# EAGLE design Lighttile (EAGLE 5.11)
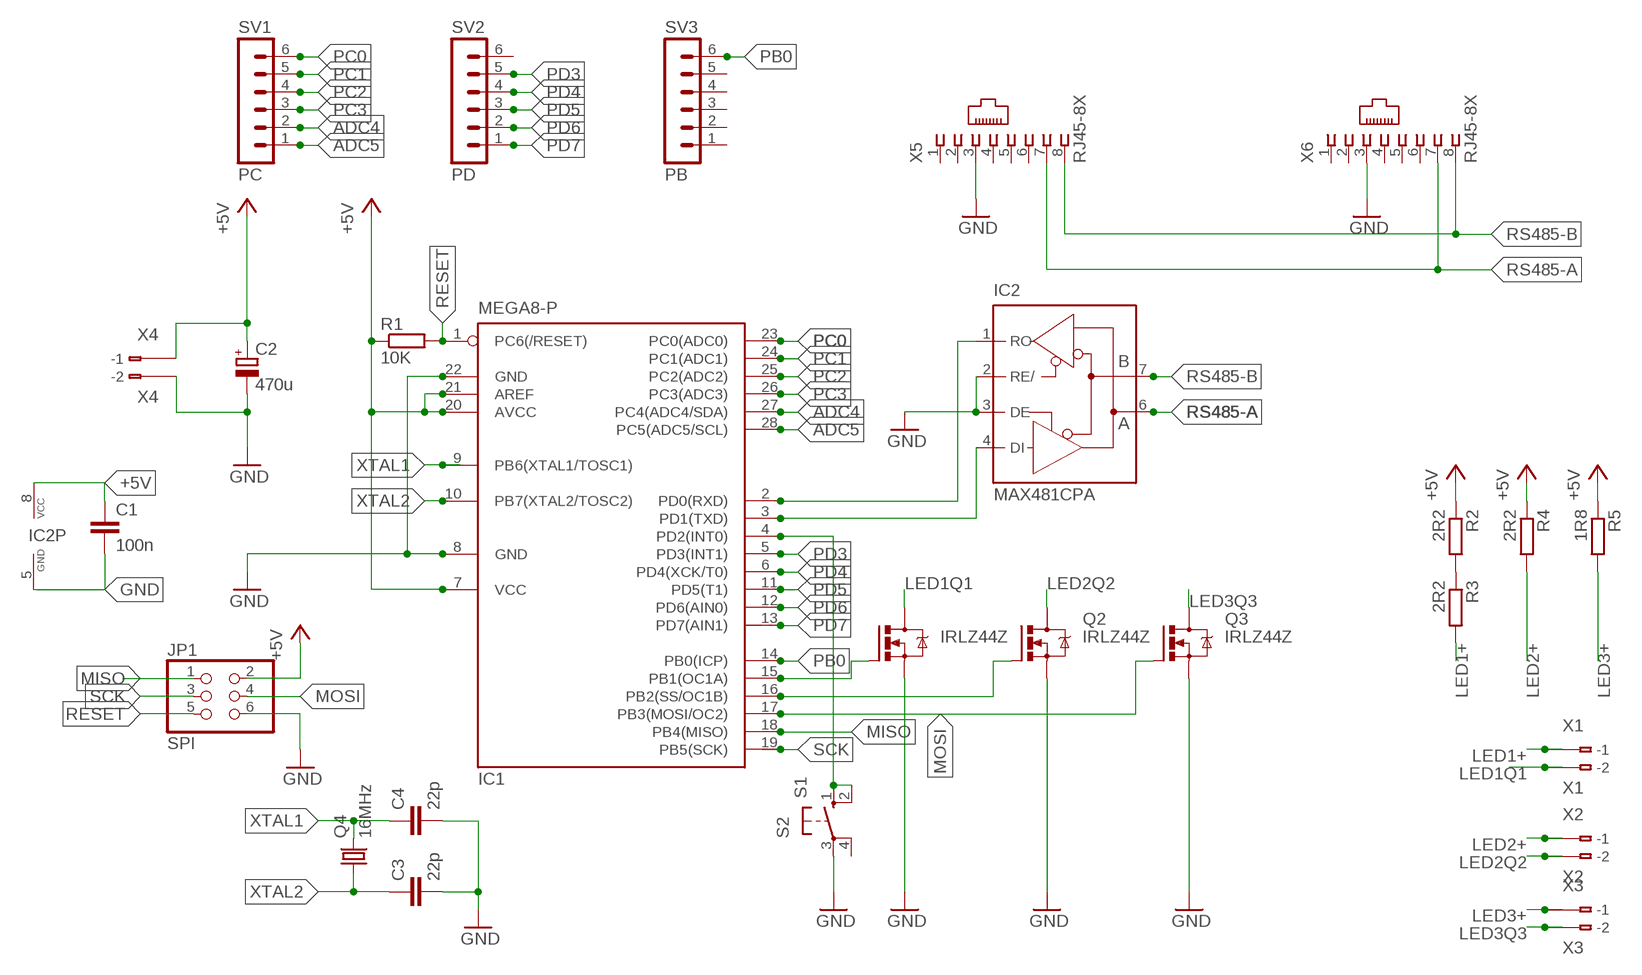
[diagram p0: schematic, sheet 1]

## Parts
C1  100n  C-EU025-024X044  [C025-024X044]
C2  470u  CPOL-EUE2.5-6  [E2,5-6]
C3  22p  C-EU025-024X044  [C025-024X044]
C4  22p  C-EU025-024X044  [C025-024X044]
IC1  MEGA8-P  [DIL28-3]
IC2  MAX481CPA  [DIL08]
JP1  SPI  PINHD-2X3  [2X03]
Q1  IRLZ44Z  [TO220BH]
Q2  IRLZ44Z  [TO220BH]
Q3  IRLZ44Z  [TO220BH]
Q4  16MHz  CRYSTALHC49S  [HC49/S]
R1  10K  R-EU_0207/15  [0207/15]
R2  2R2  R-EU_0414/15  [0414/15]
R3  2R2  R-EU_0414/15  [0414/15]
R4  2R2  R-EU_0414/15  [0414/15]
R5  1R8  R-EU_0414/15  [0414/15]
S2  S1  10-XX  [B3F-10XX]
SV1  PC  MA06-1  [MA06-1]
SV2  PD  MA06-1  [MA06-1]
SV3  PB  MA06-1  [MA06-1]
X1  X1  233-202  [233-202]
X2  X2  233-202  [233-202]
X3  X3  233-202  [233-202]
X4  X4  233-202  [233-202]
X5  RJ45-8X  [RJ45-NO-SHIELD]
X6  RJ45-8X  [RJ45-NO-SHIELD]

## Nets
+5V: C1.1 C2.+ IC1.7(VCC) IC1.20(AVCC) IC1.21(AREF) IC2.8(VCC) JP1.2 R1.1 R2.1 R4.1 R5.1 X4.B1(B-1)
ADC4: IC1.27(PC4(ADC4/SDA)) SV1.2
ADC5: IC1.28(PC5(ADC5/SCL)) SV1.1
GND: C1.2 C2.- C3.2 C4.2 IC1.8(GND) IC1.22(GND) IC2.2(RE/) IC2.3(DE) IC2.5(GND) JP1.6 Q1.S Q2.S Q3.S S2.3(P) X4.B2(B-2) X5.3 X6.3
LED1+: R3.2 X1.A1(-1) X1.B1(B-1)
LED1Q1: Q1.D X1.A2(-2) X1.B2(B-2)
LED2+: R4.2 X2.A1(-1) X2.B1(B-1)
LED2Q2: Q2.D X2.A2(-2) X2.B2(B-2)
LED3+: R5.2 X3.A1(-1) X3.B1(B-1)
LED3Q3: Q3.D X3.A2(-2) X3.B2(B-2)
MISO: IC1.18(PB4(MISO)) JP1.1
MOSI: IC1.17(PB3(MOSI/OC2)) JP1.4 Q3.G
N$1: IC1.4(PD2(INT0)) S2.1(S) S2.2(S1)
N$2: R2.2 R3.1
N$5: IC1.15(PB1(OC1A)) Q1.G
N$6: IC1.16(PB2(SS/OC1B)) Q2.G
N$18: IC1.2(PD0(RXD)) IC2.1(RO)
N$19: IC1.3(PD1(TXD)) IC2.4(DI)
PB0: IC1.14(PB0(ICP)) SV3.6
PC0: IC1.23(PC0(ADC0)) SV1.6
PC1: IC1.24(PC1(ADC1)) SV1.5
PC2: IC1.25(PC2(ADC2)) SV1.4
PC3: IC1.26(PC3(ADC3)) SV1.3
PD3: IC1.5(PD3(INT1)) SV2.5
PD4: IC1.6(PD4(XCK/T0)) SV2.4
PD5: IC1.11(PD5(T1)) SV2.3
PD6: IC1.12(PD6(AIN0)) SV2.2
PD7: IC1.13(PD7(AIN1)) SV2.1
RESET: IC1.1(PC6(/RESET)) JP1.5 R1.2
RS485-A: IC2.6(A) X5.7 X6.7
RS485-B: IC2.7(B) X5.8 X6.8
SCK: IC1.19(PB5(SCK)) JP1.3
XTAL1: C4.1 IC1.9(PB6(XTAL1/TOSC1)) Q4.2
XTAL2: C3.1 IC1.10(PB7(XTAL2/TOSC2)) Q4.1
Unconnected: S2.4(P1) SV2.6 SV3.1 SV3.2 SV3.3 SV3.4 SV3.5 X4.A1(-1) X4.A2(-2) X5.1 X5.2 X5.4 X5.5 X5.6 X6.1 X6.2 X6.4 X6.5 X6.6

## Library data of the parts
C1 C3 C4 = resistor:C-EU: CAPACITOR, European symbol
C2 = resistor:CPOL-EU: POLARIZED CAPACITOR, European symbol
IC1 = atmel:MEGA8-P: MICROCONTROLLER 8 Kbytes FLASH, 1 kbytes SRAM, 512 bytes EEPROM, USART, 4-channel 10 bit ADC, 2-channel 8 bit ADC Pin compatible with Atmega48, ATMega88, ATMega168 Source: avr.lbr; OC_FARNELL: unknown; OC_NEWARK: unknown
IC2 = maxim:MAX481CPA: RS485 TRANSEIVER; MPN: MAX481CPA+; OC_FARNELL: unknown; OC_NEWARK: 99K3445
JP1 = pinhead:PINHD-2X3: PIN HEADER
Q1-Q3 = transistor-power:IRLZ44Z: N-Channel HEXFET® Power MOSFET Logic Level AUTOMOTIVE MOSFET Source: http://www.irf.com/product-info/datasheets/data/irlz44zpbf.pdf
Q4 = crystal:CRYSTAL: CRYSTAL; OC_FARNELL: 1667008; OC_NEWARK: unknown
R1 = resistor:R-EU_: RESISTOR, European symbol
R2-R5 = rcl:R-EU_: RESISTOR, European symbol
S2 = switch-omron:10-XX: OMRON SWITCH; MPN: B3F-1000; OC_FARNELL: 176432; OC_NEWARK: 36M3542
SV1-SV3 = con-lstb:MA06-1: PIN HEADER; OC_FARNELL: unknown; OC_NEWARK: unknown
X1-X4 = con-wago:233-202: WAGO Cage Clamp; MPN: 233-202; OC_FARNELL: 1283532; OC_NEWARK: 28K9059
X5 X6 = con-tycoelectronics:RJ45: CORCOM Modular RJ Jacks No Shield Source: www.tycoelectronics.com .. ENG_DS_1654001_1099_RJ_L_0507.pdf; MPN: RJ45-8X; OC_FARNELL: unknown; OC_NEWARK: 16R6101

## Board
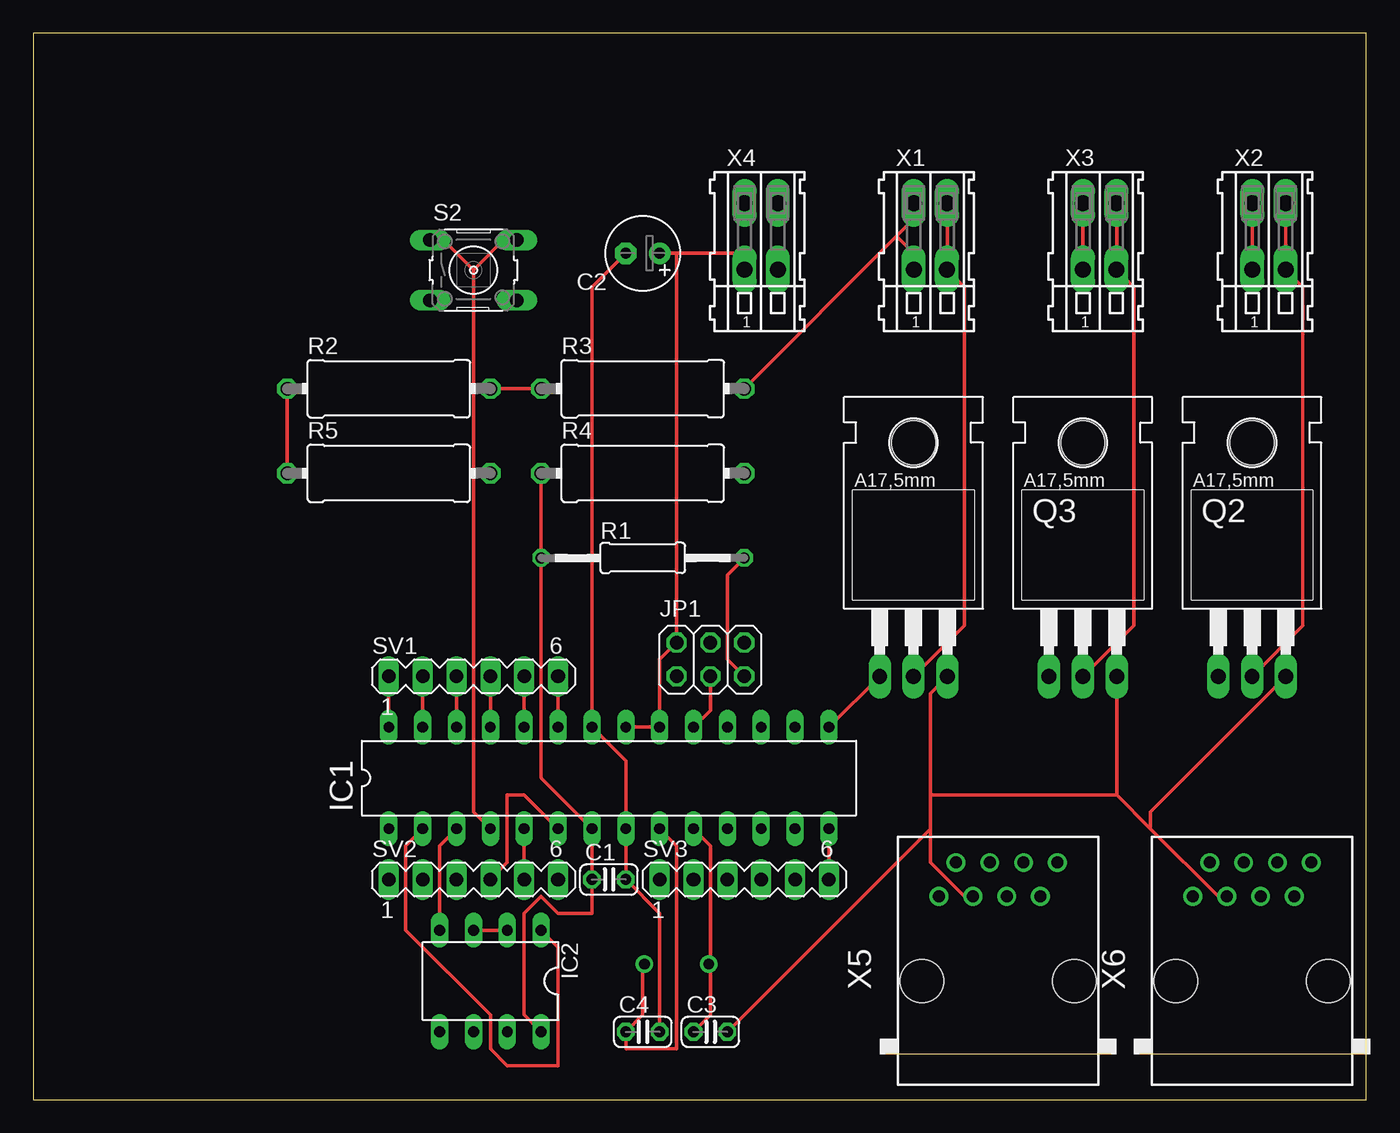
[diagram p1: board, top side]
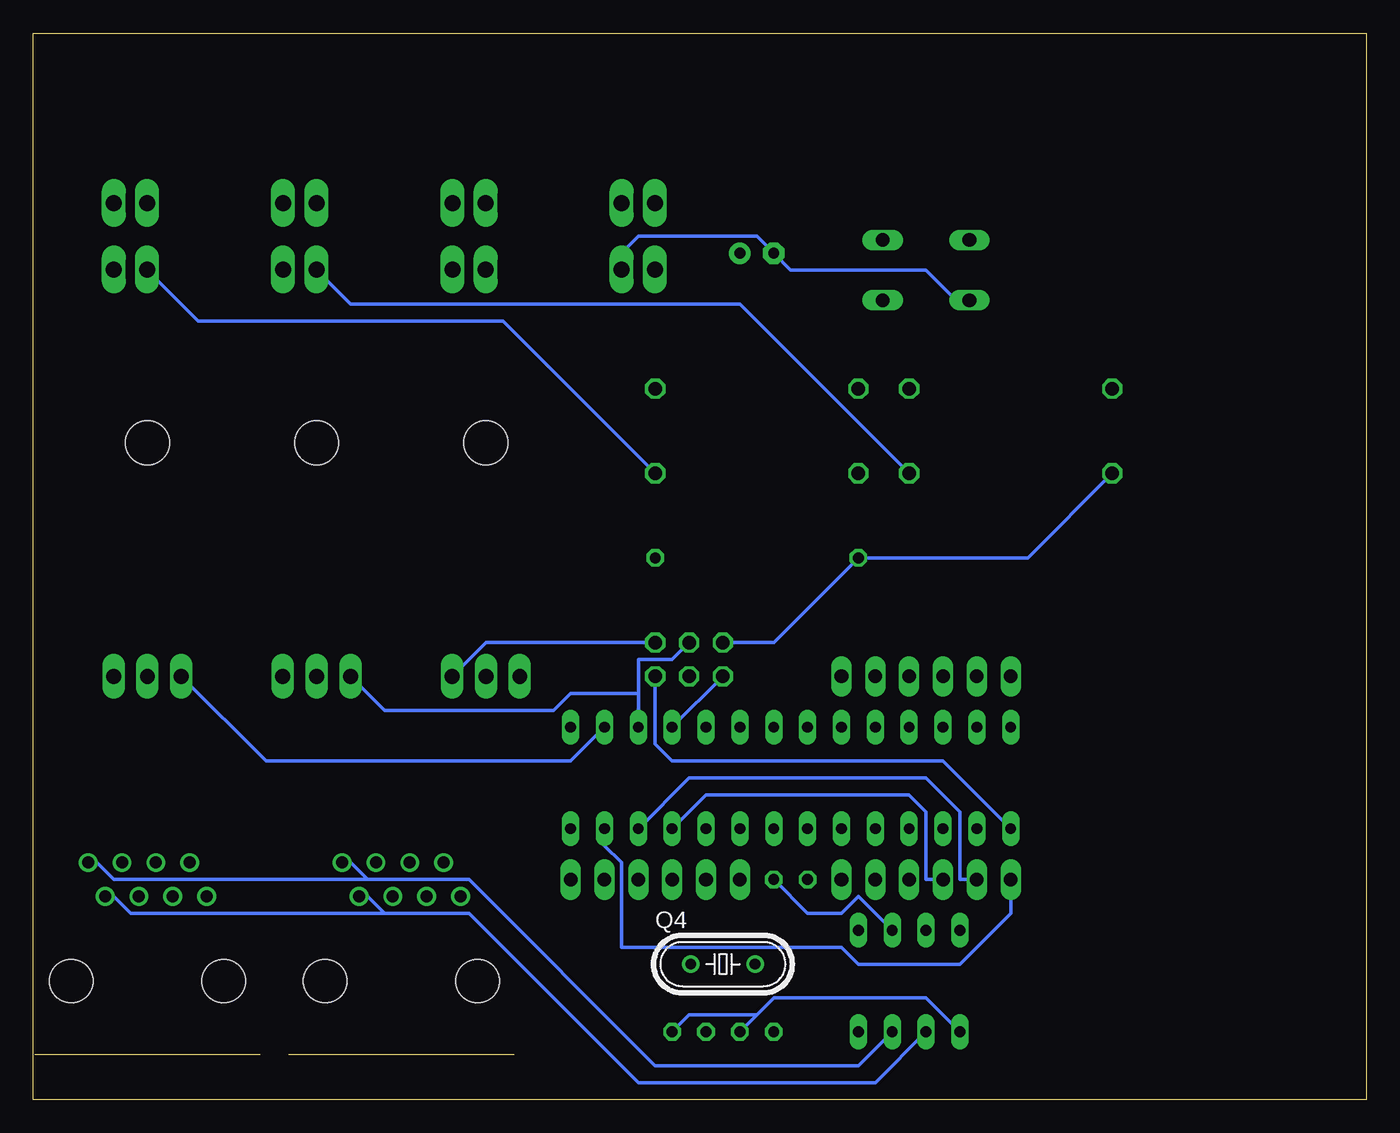
[diagram p2: board, bottom side, seen from below]

Size 100 x 80 mm. Coordinates in mm from the lower left corner, seen from the top.
Outline: 0,0 100,0 100,80 0,80 0,0
Copper layers (1*16): Top 0.035mm / dielectric 1.5mm / Bottom 0.035mm
Design rules "default": minimum track width 10mil, minimum drill 24mil, track to track 8mil, track to pad 8mil, pad to pad 8mil, via to via 8mil, smd to smd 8mil, copper to edge 40mil, drill to drill 8mil, minimum pad ring 10mil, minimum via ring 8mil, stop-mask expansion 4mil, vias tented up to drill 0mil, thermal gap 10mil

### Footprints (pad centres in the part's own frame; a part is rotated, then mirrored left to right if it is on the bottom)
C025-024X044 = drill 0.813 octagon: 1 -1.27,0; 2 1.27,0
E2,5-6 = drill 0.813 pad 1.6 round: + -1.27,0 | drill 0.813 pad 1.6 octagon: - 1.27,0
DIL28-3 = drill 0.813 long: 1 -16.51,-3.81; 2 -13.97,-3.81; 3 -11.43,-3.81; 4 -8.89,-3.81; 5 -6.35,-3.81; 6 -3.81,-3.81; 7 -1.27,-3.81; 8 1.27,-3.81; 9 3.81,-3.81; 10 6.35,-3.81; 11 8.89,-3.81; 12 11.43,-3.81; 13 13.97,-3.81; 14 16.51,-3.81; 15 16.51,3.81; 16 13.97,3.81; 17 11.43,3.81; 18 8.89,3.81; 19 6.35,3.81; 20 3.81,3.81; 21 1.27,3.81; 22 -1.27,3.81; 23 -3.81,3.81; 24 -6.35,3.81; 25 -8.89,3.81; 26 -11.43,3.81; 27 -13.97,3.81; 28 -16.51,3.81
DIL08 = drill 0.813 long: 1 -3.81,-3.81; 2 -1.27,-3.81; 3 1.27,-3.81; 4 3.81,-3.81; 5 3.81,3.81; 6 1.27,3.81; 7 -1.27,3.81; 8 -3.81,3.81
2X03 = drill 1.016 octagon: 1 -2.54,-1.27; 2 -2.54,1.27; 3 0,-1.27; 4 0,1.27; 5 2.54,-1.27; 6 2.54,1.27
TO220BH = drill 1.118 long: D 0,-6.35; G -2.54,-6.35; S 2.54,-6.35 | hole 3.302: 0,11.176
HC49/S = drill 0.813 round: 1 -2.413,0; 2 2.413,0
0207/15 = drill 0.813 octagon: 1 -7.62,0; 2 7.62,0
0414/15 = drill 1.016 octagon: 1 -7.62,0; 2 7.62,0
B3F-10XX = drill 1.016 long: 1 -3.251,2.261; 2 3.251,2.261; 3 -3.251,-2.261; 4 3.251,-2.261
MA06-1 = drill 1.016 long: 1 -6.35,0; 2 -3.81,0; 3 -1.27,0; 4 1.27,0; 5 3.81,0; 6 6.35,0
233-202 = drill 1.2 long: A1 -1.25,2.5; A2 1.25,2.5; B1 -1.25,-2.5; B2 1.25,-2.5
RJ45-NO-SHIELD = drill 0.9 pad 1.4 round: 1 -4.445,6.35; 2 -3.175,8.89; 3 -1.905,6.35; 4 -0.635,8.89; 5 0.635,6.35; 6 1.905,8.89; 7 3.175,6.35; 8 4.445,8.89 | hole 3.251: -5.715,0; 5.715,0

### Placement (x,y rotation side)
C1  43.18,16.51 0 top
C2  45.72,63.5 180 top
C3  50.8,5.08 0 top
C4  45.72,5.08 0 top
IC1  43.18,24.13 0 top
IC2  34.29,8.89 180 top
JP1  50.8,33.02 0 top
Q1  66.04,38.1 0 top
Q2  91.44,38.1 0 top
Q3  78.74,38.1 0 top
Q4  48.26,10.16 0 bottom
R1  45.72,40.64 0 top
R2  26.67,53.34 0 top
R3  45.72,53.34 0 top
R4  45.72,46.99 0 top
R5  26.67,46.99 0 top
S2  33.02,62.23 0 top
SV1  33.02,31.75 0 top
SV2  33.02,16.51 0 top
SV3  53.34,16.51 0 top
X1  67.31,64.77 0 top
X2  92.71,64.77 0 top
X3  80.01,64.77 0 top
X4  54.61,64.77 0 top
X5  72.39,8.89 0 top
X6  91.44,8.89 0 top

### Tracks (layer width: path | path; a pad name or v marks a point on that pad's centre or on a via)
+5V
  Top 0.254: IC2.8 36.83,6.35 36.83,13.97 38.1,15.24 39.37,13.97 41.91,13.97 C1.1 IC1.7 38.1,24.13 R1.1 R4.1 | 48.26,63.5 53.34,63.5 X4.B1 | 48.26,63.5 C2.+ | R5.1 R2.1 | IC1.21 IC1.20 46.99,33.02 JP1.2 48.26,63.5
  Bottom 0.254: JP1.2 44.45,34.29 R1.1 25.4,40.64 R5.1
ADC4
  Top 0.254: IC1.27 SV1.2
ADC5
  Top 0.254: IC1.28 SV1.1
GND
  Top 0.254: 81.28,22.86 83.82,20.32 | 83.82,20.32 88.9,15.24 X6.3 | 81.28,22.86 Q3.S | Q2.S 83.82,21.59 83.82,20.32 | IC2.2 IC2.3 | 67.31,22.86 67.31,30.48 Q1.S | 67.31,20.32 67.31,22.86 | 67.31,20.32 67.31,17.78 69.85,15.24 X5.3 | C3.2 67.31,20.32 | C4.2 46.99,13.97 C1.2 IC1.8 44.45,25.4 IC1.22 41.91,60.96 C2.- | 67.31,22.86 81.28,22.86
  Bottom 0.254: S2.3 30.48,59.69 33.02,62.23 43.18,62.23 C2.- 45.72,64.77 54.61,64.77 55.88,63.5 X4.B2 | IC2.2 38.1,15.24 39.37,13.97 41.91,13.97 C1.2 | IC2.5 33.02,7.62 44.45,7.62 45.72,6.35 | 45.72,6.35 C4.2 | C3.2 50.8,6.35 45.72,6.35 | JP1.6 66.04,34.29 Q1.S
LED1+
  Top 0.254: 64.77,64.77 66.04,66.04 X1.A1 | R3.2 64.77,64.77 | 64.77,64.77 66.04,63.5 X1.B1
LED1Q1
  Top 0.254: Q1.D 69.85,35.56 69.85,60.96 68.58,62.23 X1.B2 68.58,63.5 68.58,66.04 X1.A2
LED2+
  Top 0.254: X2.A1 91.44,66.04 91.44,63.5 X2.B1
  Bottom 0.254: R4.2 64.77,58.42 87.63,58.42 91.44,62.23 X2.B1
LED2Q2
  Top 0.254: Q2.D 95.25,35.56 95.25,60.96 93.98,62.23 X2.B2 93.98,63.5 93.98,66.04 X2.A2
LED3+
  Top 0.254: X3.A1 78.74,66.04 78.74,63.5 X3.B1
  Bottom 0.254: R5.2 46.99,59.69 76.2,59.69 78.74,62.23 X3.B1
LED3Q3
  Top 0.254: Q3.D 82.55,35.56 82.55,60.96 81.28,62.23 X3.B2 81.28,63.5 81.28,66.04 X3.A2
MISO
  Bottom 0.254: JP1.1 IC1.18
MOSI
  Bottom 0.254: 54.61,30.48 54.61,33.02 52.07,33.02 JP1.4 | IC1.17 54.61,30.48 | Q3.G 73.66,29.21 60.96,29.21 59.69,30.48 54.61,30.48
N$1
  Top 0.254: IC1.4 33.02,21.59 33.02,62.23 | 33.02,62.23 30.48,64.77 S2.1 | 33.02,62.23 35.56,64.77 S2.2
N$2
  Top 0.254: R2.2 R3.1
N$5
  Top 0.254: IC1.15 Q1.G
N$6
  Bottom 0.254: IC1.16 59.69,25.4 82.55,25.4 Q2.G
N$18
  Top 0.254: IC1.2 27.94,19.05 27.94,12.7 34.29,6.35 34.29,3.81 35.56,2.54 39.37,2.54 39.37,11.43 IC2.1
N$19
  Top 0.254: IC2.4 30.48,19.05 IC1.3
PB0
  Top 0.254: SV3.6 IC1.14
PC0
  Top 0.254: IC1.23 SV1.6
PC1
  Top 0.254: IC1.24 SV1.5
PC2
  Top 0.254: IC1.25 SV1.4
PC3
  Top 0.254: IC1.26 SV1.3
PD3
  Top 0.254: SV2.5 IC1.5
PD4
  Top 0.254: IC1.6 36.83,22.86 35.56,22.86 35.56,17.78 SV2.4
PD5
  Bottom 0.254: IC1.11 49.53,22.86 34.29,22.86 33.02,21.59 33.02,16.51 SV2.3
PD6
  Bottom 0.254: IC1.12 50.8,24.13 33.02,24.13 30.48,21.59 30.48,16.51 SV2.2
PD7
  Bottom 0.254: IC1.13 57.15,19.05 55.88,17.78 55.88,11.43 39.37,11.43 38.1,10.16 30.48,10.16 26.67,13.97 SV2.1
RESET
  Top 0.254: R1.2 52.07,39.37 52.07,33.02 JP1.5
  Bottom 0.254: IC1.1 31.75,25.4 52.07,25.4 53.34,26.67 JP1.5
RS485-A
  Bottom 0.254: IC2.6 36.83,1.27 54.61,1.27 67.31,13.97 73.66,13.97 | 73.66,13.97 74.93,15.24 X5.7 | 73.66,13.97 92.71,13.97 93.98,15.24 X6.7
RS485-B
  Bottom 0.254: IC2.7 38.1,2.54 53.34,2.54 67.31,16.51 74.93,16.51 | 74.93,16.51 76.2,17.78 X5.8 | 74.93,16.51 93.98,16.51 95.25,17.78 X6.8
SCK
  Top 0.254: IC1.19 50.8,29.21 JP1.3
XTAL1
  Top 0.254: Q4.2 45.72,10.16 45.72,6.35 C4.1 44.45,3.81 48.26,3.81 48.26,19.05 IC1.9
XTAL2
  Top 0.254: C3.1 50.8,6.35 50.8,10.16 | 50.8,10.16 Q4.1 50.8,10.16 | IC1.10 50.8,19.05 50.8,10.16